# EAGLE design fabflash-mk-2.3-booster (EAGLE 6.5.0)
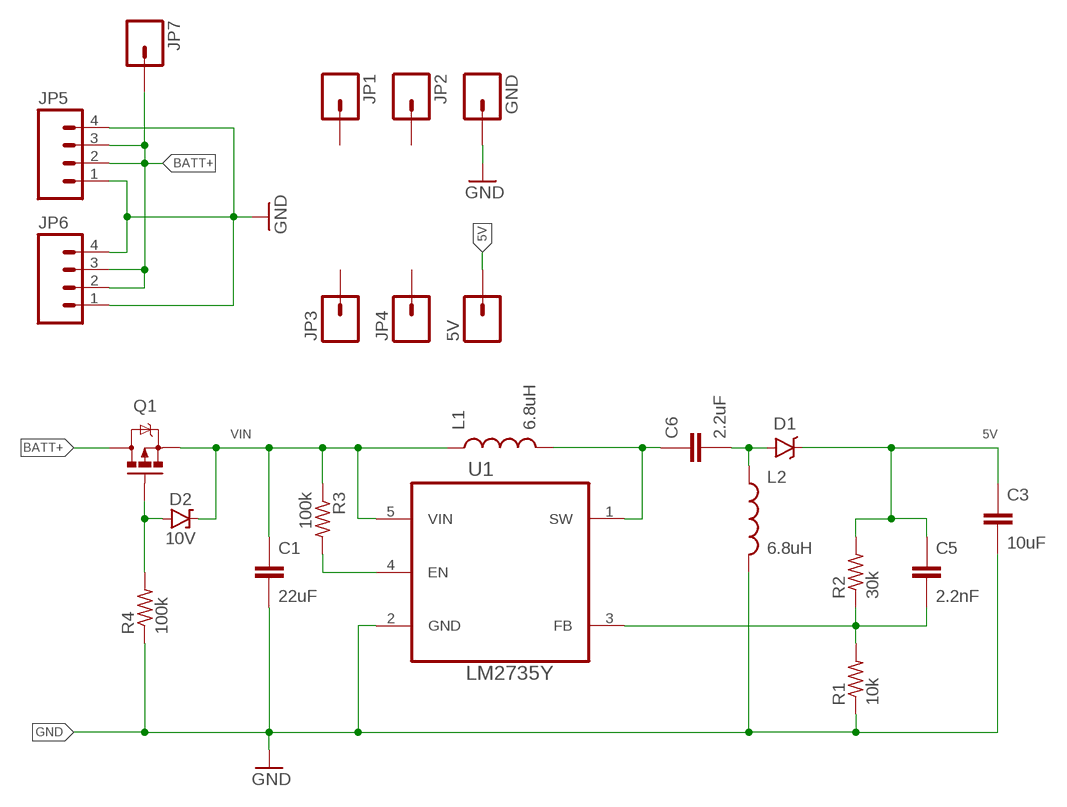
[diagram p0: schematic, sheet 1]

## Parts
5V  M01PTH-0.9MM  [1X01-0.9MM]
C1  22uF  CAPACITOR-CERAMICC0805  [C0805]
C3  10uF  CAPACITOR-CERAMICC0805  [C0805]
C5  2.2nF  CAPACITOR-CERAMICC0603  [C0603]
C6  2.2uF  CAPACITOR-CERAMICC0805  [C0805]
D1  B340A  DIODE-SCHOTTKYSMA  [SMA-DIODE-SCHOTTKY]
D2  10V  DIODE-ZENERSOD123  [SOD123-ZENER]
GND  M01PTH-0.9MM  [1X01-0.9MM]
JP1  M01PTH-0.9MM-NS  [1X01-0.9MM-NS]
JP2  M01PTH-0.9MM-NS  [1X01-0.9MM-NS]
JP3  M01PTH-0.9MM-NS  [1X01-0.9MM-NS]
JP4  M01PTH-0.9MM-NS  [1X01-0.9MM-NS]
JP5  M04SMD-SHORT-NS  [1X04-SMD-SHORT]
JP6  M04SMD-SHORT-NS  [1X04-SMD-SHORT]
JP7  M01NOT-A-VIA-NOPE  [1X01_NOSILK_NOSTOP]
L1  6.8uH  INDUCTORTAIYO-YUDEN-40XX  [TAIYO-YUDEN-40XX]
L2  6.8uH  INDUCTORTAIYO-YUDEN-40XX  [TAIYO-YUDEN-40XX]
Q1  MOSFET-PCHANNELIRLML2244  [SOT23-3]
R1  10k  RESISTORR0603  [R0603]
R2  30k  RESISTORR0603  [R0603]
R3  100k  RESISTORR0603  [R0603]
R4  100k  RESISTORR0603  [R0603]
U1  LM2735Y  LM2735YMF  [SOT95P285X110-5N]

## Nets
5V: 5V.1 C3.1 C5.1 D1.C R2.2
BATT+: JP5.2 JP5.3 JP6.2 JP6.3 JP7.P$1 Q1.3(D)
GND: C1.2 C3.2 GND.1 JP5.1 JP5.4 JP6.1 JP6.4 L2.2 R1.1 R4.1 U1.2(GND)
N$1: C6.1 L1.2 U1.1(SW)
N$2: R3.2 U1.4(EN)
N$4: D2.A Q1.1(G) R4.2
N$6: C6.2 D1.A L2.1
N$8: C5.2 R1.2 R2.1 U1.3(FB)
VIN: C1.1 D2.C L1.1 Q1.2(S) R3.1 U1.5(VIN)
Unconnected: JP1.1 JP2.1 JP3.1 JP4.1

## Library data of the parts
5V GND JP1-JP4 JP7 = A_butts:M01: Header 1 Standard 1-pin 0.1" header. Use with straight break away headers (SKU : PRT-00116), right angle break away headers (PRT-00553), swiss pins (PRT-00743), machine pins (PRT-00117), and female headers (PRT-00115).
C1 C3 C5 C6 = A_butts:CAPACITOR-CERAMIC: CAPACITOR, European symbol
D1 = A_butts:DIODE-SCHOTTKY: Schottky diodes in SFE's production catalog BAT20J 1A 23V 0.62Vf RB751 120mA 40V 0.37Vf PMEG4005EJ 0.5A 40V 0.42Vf MBRA140 1A 40V 0.5Vf B340A 3A 40V SMA
D2 = A_butts:DIODE-ZENER: Zener Diode Production Part - 8199 3.4V Zener Voltage
JP5 JP6 = A_butts:M04: Header 4 Standard 4-pin 0.1" header. Use with straight break away headers (SKU : PRT-00116), right angle break away headers (PRT-00553), swiss pins (PRT-00743), machine pins (PRT-00117), and female headers (PRT-00115). Molex polarized connector foot print use with SKU : PRT-08231 with associated crimp pins and housings. 1MM SMD Version SKU: PRT-10208
L1 L2 = A_butts:INDUCTOR: Inductors Basic Inductor/Choke - 0603 and 1206. Footprints are not proven and vary greatly between part numbers. SRN6045- 33uH, 20% 1.4A SDR0403-560KL - 56uH, 10%, 500mA RMS/740mA peak
Q1 = A_butts:MOSFET-PCHANNEL: Generic PMOSFET IRLML2244 - TRANS-11153 (SOT-23 -20V -4.3A) (1.Gate 2.Source 3.Drain) FQP27P06 - COM-10349 <http://www.sparkfun.com/products/10349> (TO-220 -60V -27A) (1.Gate 2.Source 3.Drain); PROD_ID: TRANS-11153
R1-R4 = A_butts:RESISTOR: RESISTOR, American symbol
U1 = A_butts:LM2735YMF: IC BOOST SEPIC ADJ 2.1A; MPN: LM2735YMF; OC_FARNELL: 1426509; OC_NEWARK: 50M8801; PACKAGE: SOT23-5; SUPPLIER: National Semiconductor

## Board
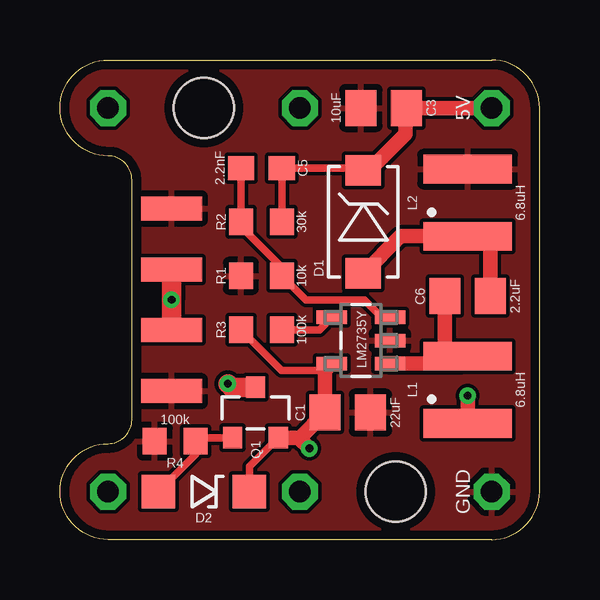
[diagram p1: board, top side]
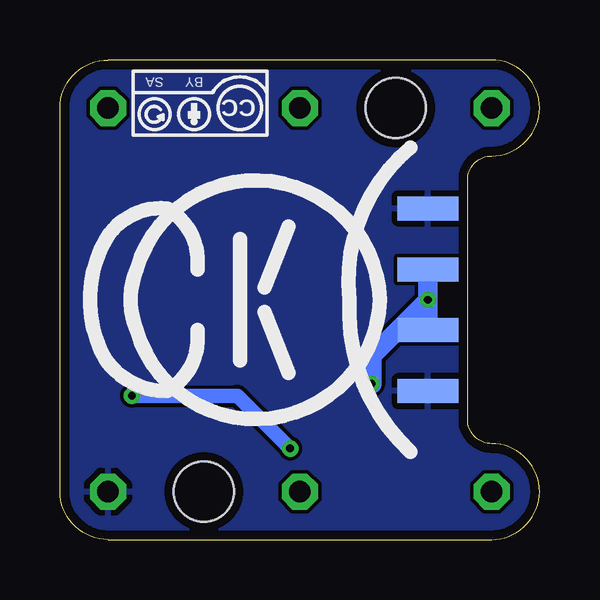
[diagram p2: board, bottom side, seen from below]

Size 20 x 20 mm. Coordinates in mm from the lower left corner, seen from the top.
Outline: 18,0 2,0 arc-90 0,2 arc-90 2,4 arc90 3,5 3,15 arc90 2,16 arc-90 0,18 arc-90 2,20 18,20 arc-90 20,18 20,2 arc-90 18,0
Copper layers (1*16): Top 0.0356mm / dielectric 1.5011mm / Bottom 0.0356mm
Design rules "LaenPCBOrder2": minimum track width 6mil, minimum drill 13mil, track to track 6mil, track to pad 6mil, pad to pad 6mil, via to via 6mil, smd to smd 6mil, copper to edge 15mil, drill to drill 6mil, minimum pad ring 7mil, minimum via ring 7mil, stop-mask expansion 3mil, vias tented up to drill 20mil, thermal gap 10mil
Holes 2.5 mm at 6,18 14,2

### Footprints (pad centres in the part's own frame; a part is rotated, then mirrored left to right if it is on the bottom)
1X01-0.9MM = drill 0.9 pad 1.5 octagon: 1 0,0
C0805 = smd 1.3 x 1.5: 1 -0.95,0; 2 0.95,0
C0603 = smd 1.1 x 1: 1 -0.85,0; 2 0.85,0
SMA-DIODE-SCHOTTKY = smd 1.27 x 1.47: A -2.15,0; C 2.15,0
SOD123-ZENER = smd 1.4 x 1.4: A -1.9,0; C 1.9,0
1X01-0.9MM-NS = drill 0.9 pad 1.5 octagon: 1 0,0
1X04-SMD-SHORT = smd 1 x 2.54: 1 -3.81,0; 2 -1.27,0; 3 1.27,0; 4 3.81,0
1X01_NOSILK_NOSTOP = drill 0.33: P$1 0,0
TAIYO-YUDEN-40XX = smd 1.2 x 3.7: 1 -1.4,0; 2 1.4,0
SOT23-3 = smd 0.8 x 0.9: 1 -0.95,-1; 2 0.95,-1; 3 0,1.1
R0603 = smd 1 x 1.1: 1 -0.85,0; 2 0.85,0
SOT95P285X110-5N = smd 1.27 x 0.559: 1 -1.219,0.965; 2 -1.219,0; 3 -1.219,-0.965; 4 1.219,-0.965; 5 1.219,0.965

### Placement (x,y rotation side)
5V  18,18 90 top
C1  12,5.3 0 top
C3  13.5,18 180 top
C5  8.4,15.5 180 top
C6  17,10.15 0 top
D1  12.65,13.25 90 top
D2  6,2 0 top
GND  18,2 90 top
JP1  2,18 0 top
JP2  10,18 0 top
JP3  2,2 90 top
JP4  10,2 0 top
JP5  4.65,10 90 top
JP6  4.65,10 90 bottom
JP7  7,6.5 0 top
L1  17,6.25 90 top
L2  17,14.05 90 top
Q1  8.15,5.25 0 top
R1  8.4,11 0 top
R2  8.4,13.25 0 top
R3  8.4,8.75 0 top
R4  4.8,4.1 0 top
U1  12.55,8.3 180 top
U$1  [COW]  13,10 270 bottom
U$2  [CC-BY-SA-4.0-NO-URL]  12.5,18 180 bottom

### Tracks (layer width: path | path; a pad name or v marks a point on that pad's centre or on a via)
5V
  Top 0.305: R2.2 C5.1 12.15,15.5 D1.C
  Top 0.61: D1.C 12.9,15.4 14.4,16.9 14.4,17.95 C3.1 5V.1
BATT+  (via drill 0.33)
  Top 0.813: Q1.3 7.15,6.35 JP7.P$1 | JP6.3 v4.65,10 JP6.2
  Bottom 0.813: JP6.3 v4.65,10 | JP6.2 v4.65,10 | v4.65,10 7,7.65 JP7.P$1
GND
  pour Top (rank 6): 0,20 18,20 arc-90 20,18 20,2 arc-90 18,0 0,0
  pour Bottom (rank 6): 0,20 18,20 arc-90 20,18 20,2 arc-90 18,0 0,0
N$1
  Top 0.61: U1.1 16.1,7.33 | 16.1,7.33 16.68,7.33 L1.2 | C6.1 16.05,7.38 16.1,7.33
N$2
  Top 0.305: R3.2 10.82,8.75 U1.4
N$4
  Top 0.305: D2.A 5.65,3.55 R4.2 5.8,4.25 Q1.1
N$6
  Top 0.61: D1.A 14.2,12.65 L2.1 17.15,12.5 17.9,12.5 17.95,12.45 C6.2
N$8
  Top 0.305: C5.2 R2.1 7.55,13.05 9.2,11.4 9.2,11.05 R1.2 10.25,10 12.7,10 13.44,9.27 U1.3
VIN  (via drill 0.33)
  Top 0.305: 11.05,7.05 9.25,7.05 R3.1 | D2.C 7.9,3.05 Q1.2
  Top 0.61: v10.4,3.8 9.95,4.25 | 9.95,4.25 Q1.2 | 9.95,4.25 10,4.25 C1.1 11.05,7.05 U1.5 | L1.1 v17,6
  Bottom 0.61: v17,6 12.6,6 v10.4,3.8